# EAGLE design relay_pro_eagle7x (EAGLE 7.7.0)
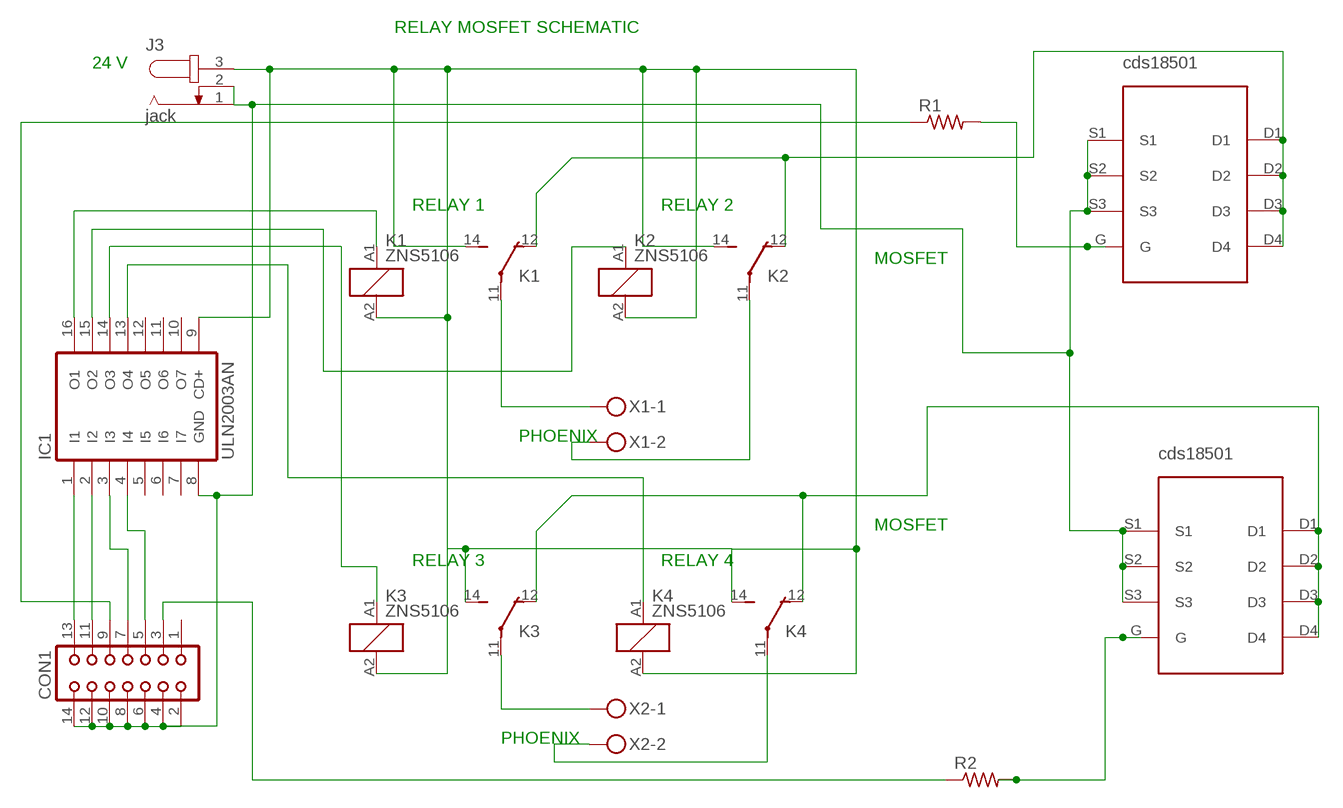
[diagram p0: schematic, sheet 1]

## Parts
CON1  CON14  [CON14]
IC1  ULN2003AN  [DIL16]
J3  jack  JACK-PLUG0  [SPC4077]
K1  ZNS5106  [ZN5]
K2  ZNS5106  [ZN5]
K3  ZNS5106  [ZN5]
K4  ZNS5106  [ZN5]
R1  R-US_R0603  [R0603]
R2  R-US_R0603  [R0603]
U$1  CSD18503GDS-NEW  [CDS]
U$2  CSD18503GDS-NEW  [CDS]
X1  MKDSN1,5/2-5,08  [MKDSN1,5/2-5,08]
X2  MKDSN1,5/2-5,08  [MKDSN1,5/2-5,08]

## Nets
N$1: K1.11(2:P) X1.1
N$2: IC1.16(O1) K1.A1
N$3: K2.11(2:P) X1.2
N$4: IC1.15(O2) K2.A1
N$5: K3.11(2:P) X2.1
N$6: IC1.9(CD+) J3.3 K1.14(2:S) K1.A2 K2.14(2:S) K2.A2 K3.14(2:S) K3.A2 K4.14(2:S) K4.A2
N$7: CON1.13 IC1.1(I1)
N$8: K4.11(2:P) X2.2
N$9: CON1.11 IC1.2(I2)
N$10: CON1.7 IC1.3(I3)
N$11: IC1.14(O3) K3.A1
N$12: IC1.13(O4) K4.A1
N$13: CON1.9 R1.1
N$15: K3.12(2:O) K4.12(2:O) U$2.D1 U$2.D2 U$2.D3 U$2.D4
N$16: CON1.3 R2.1
N$17: R2.2 U$2.G
N$18: CON1.5 IC1.4(I4)
N$19: K1.12(2:O) K2.12(2:O) U$1.D1 U$1.D2 U$1.D3 U$1.D4
N$21: R1.2 U$1.G
N$23: CON1.2 CON1.4 CON1.6 CON1.8 CON1.10 CON1.12 CON1.14 IC1.8(GND) J3.1 J3.2 U$1.S1 U$1.S2 U$1.S3 U$2.S1 U$2.S2 U$2.S3
Unconnected: CON1.1 IC1.5(I5) IC1.6(I6) IC1.7(I7) IC1.10(O7) IC1.11(O6) IC1.12(O5)

## Notes on the sheet
- RELAY MOSFET SCHEMATIC
- 24 V
- RELAY 1 | RELAY 2
- MOSFET
- PHOENIX
- MOSFET
- RELAY 3 | RELAY 4
- PHOENIX

## Library data of the parts
CON1 = con-harting:CON14: CONNECTOR
IC1 = uln-udn:ULN2003A: DRIVER ARRAY
J3 = con-jack:JACK-PLUG: DC POWER JACK Power Jack, DC, Right Angle, Through Hole, Rated 5A at 16VDC, PC Terminals Distributor: Farnell (www.Farnell.de) Drawing: 84N1161.pdf / 84N1162.pdf Manufacturer: SPC Technology (www.spctechnology.com) Type: SPC4077 / SPC 4078
K1-K4 = relay1:ZNS5*: Miniature Power PCB Relay SCHRACK 1pole 10 A Source: http://www.schrack.com/.. 5847.pdf
R1 R2 = rcl:R-US_: RESISTOR, American symbol
U$1 U$2 = cds_new:CSD18503GDS-NEW
X1 X2 = con-phoenix-508:MKDSN1,5/2-5,08: MKDSN 1,5/ 2-5,08 Printklemme Nennstrom: 13,5 A Nennspannung: 250 V Rastermaß: 5,08 mm Polzahl: 2 Anschlussart: Schraubanschluss Montage: Löten Anschlussrichtung Leiter/Platine: 0 ° Artikelnummer: 1729128 Source: http://eshop.phoenixcontact.com .. 1729128.pdf

## Board
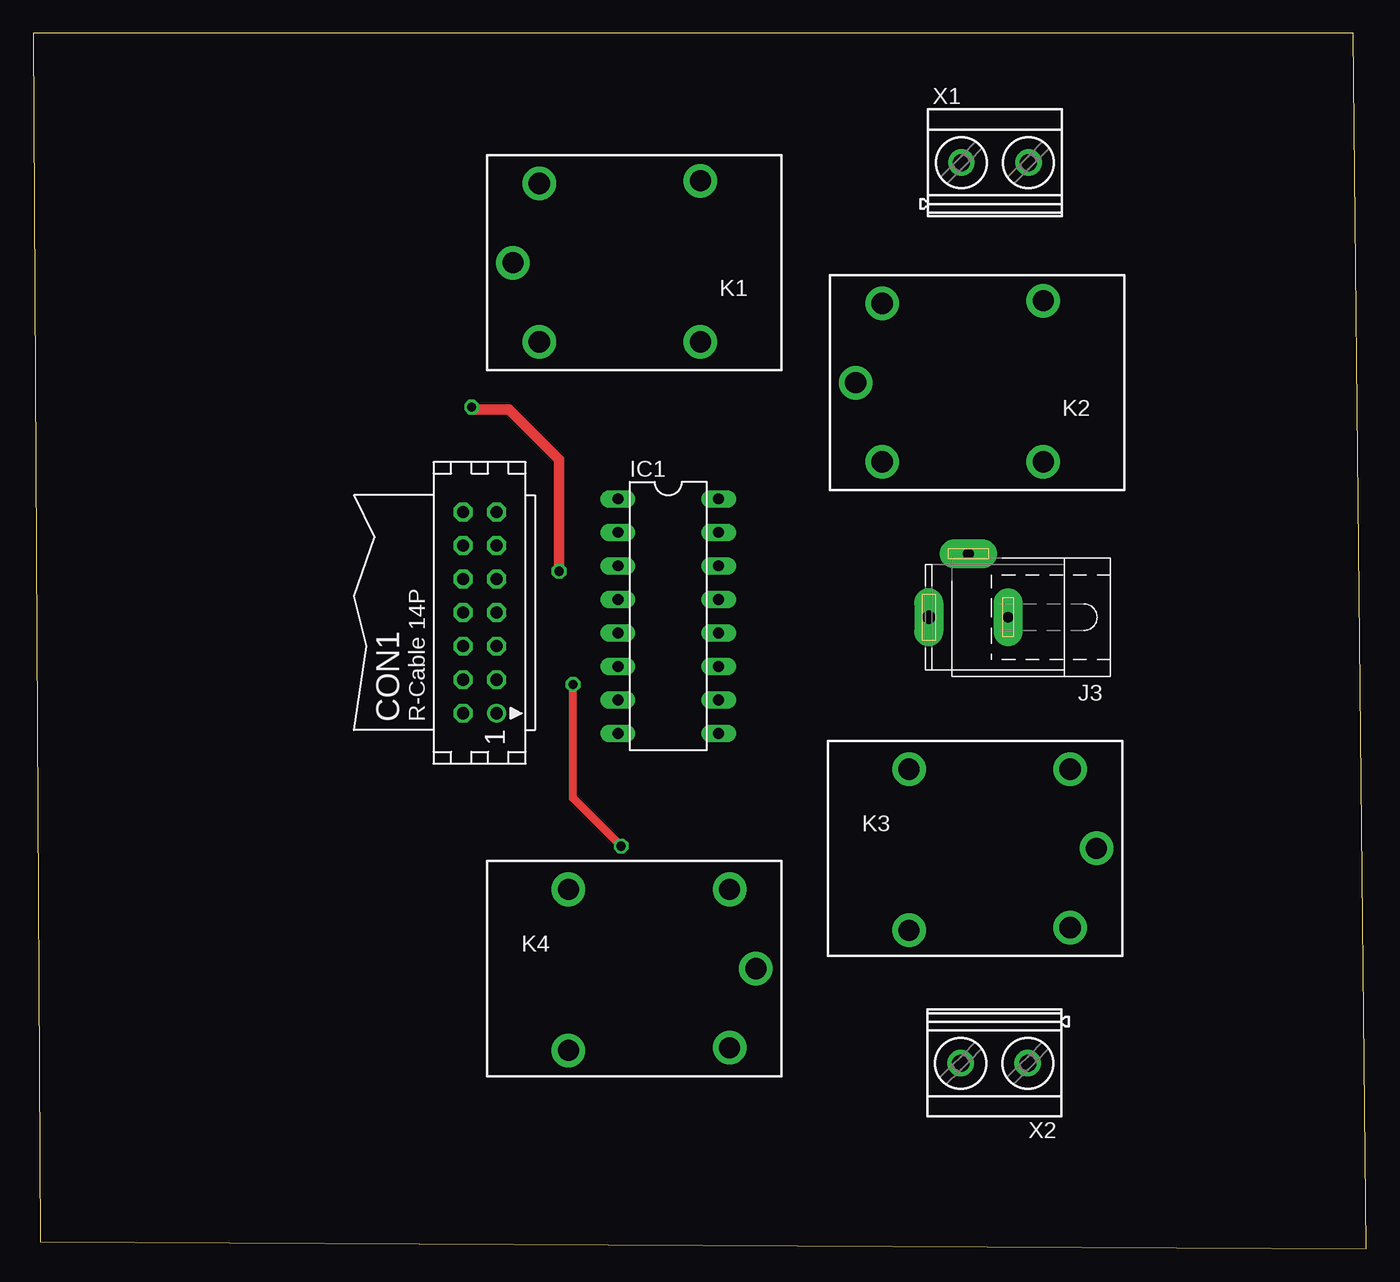
[diagram p1: board, top side]
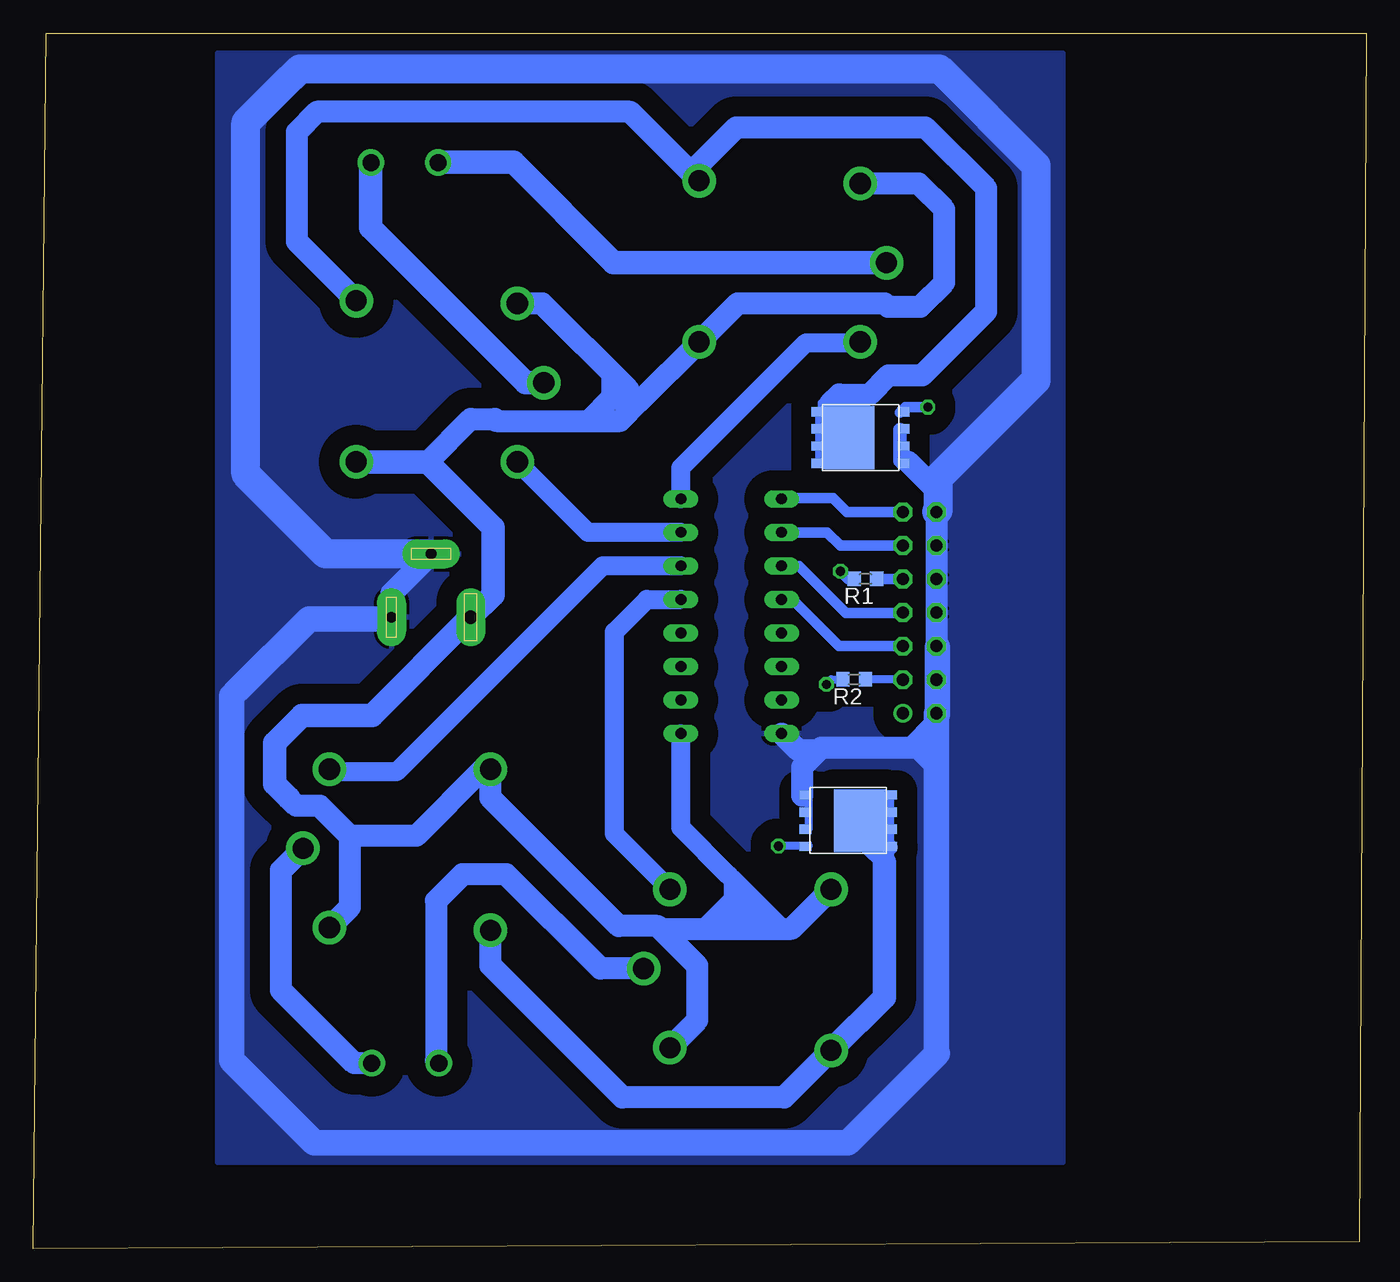
[diagram p2: board, bottom side, seen from below]

Size 101 x 92.08 mm. Coordinates in mm from the lower left corner, seen from the top.
Outline: 0.54,0.54 101,0 100,92.08 0,92.08 0.54,0.54
Copper layers (1*16): Top 0.035mm / dielectric 1.5mm / Bottom 0.035mm
Design rules "default *": minimum track width 10mil, minimum drill 24mil, track to track 60mil, track to pad 60mil, pad to pad 60mil, via to via 60mil, smd to smd 8mil, copper to edge 40mil, drill to drill 8mil, minimum pad ring 10mil, minimum via ring 8mil, stop-mask expansion 4mil, vias tented up to drill 0mil, thermal gap 10mil

### Footprints (pad centres in the part's own frame; a part is rotated, then mirrored left to right if it is on the bottom)
CON14 = drill 0.914: 1 -7.62,-1.27 | drill 0.914 octagon: 2 -7.62,1.27; 3 -5.08,-1.27; 4 -5.08,1.27; 5 -2.54,-1.27; 6 -2.54,1.27; 7 0,-1.27; 8 0,1.27; 9 2.54,-1.27; 10 2.54,1.27; 11 5.08,-1.27; 12 5.08,1.27; 13 7.62,-1.27; 14 7.62,1.27
DIL16 = drill 0.813 long: 1 -8.89,-3.81; 2 -6.35,-3.81; 3 -3.81,-3.81; 4 -1.27,-3.81; 5 1.27,-3.81; 6 3.81,-3.81; 7 6.35,-3.81; 8 8.89,-3.81; 9 8.89,3.81; 10 6.35,3.81; 11 3.81,3.81; 12 1.27,3.81; 13 -1.27,3.81; 14 -3.81,3.81; 15 -6.35,3.81; 16 -8.89,3.81
SPC4077 = drill 0.8 pad 2.184 long: 1 -3,0; 2 0,-4.8 | drill 1 pad 2.184 long: 3 3,0
ZN5 = drill 1.6 pad 2.54: 11 8.89,0; 12 -5.31,-6.2; 14 -5.31,6; A1 6.89,6; A2 6.89,-6
R0603 = smd 1 x 1.1: 1 -0.85,0; 2 0.85,0
CDS = smd 0.406 x 0.203: D1 1,-0.9; D2 1,0.4; D3 1,1.7; D4 1,3; G 7.1,2.9; P$1 7.2,3.1; P$2 7.2,2.9; P$3 7.2,2.7; P$4 7.5,1.9; P$5 7.6,3.1; P$6 7.6,2.9; P$7 7.6,2.7; P$8 7.6,1.9; P$9 7.1,3.1; P$11 7.1,2.7; P$12 7.5,1.7; P$13 7.2,-1.1; P$14 7.6,-1.1; P$16 7.6,-0.9; P$17 7.1,-0.9; P$18 7.1,-1.1; P$19 7.1,-0.7; P$20 7.5,-0.7; P$21 7.6,-0.7; P$22 7.1,-1.2; P$23 7.5,-1.2; P$24 7.6,-1.2; P$25 7.1,3.2; P$26 7.5,3.2; P$27 7.6,3.2; P$28 7.1,0.1; P$30 7.1,0.5; P$31 7.1,0.6; P$32 7.1,1.4; P$34 7.1,1.8; P$35 7.1,1.9; P$36 7.6,1.7; P$37 7.5,1.5; P$38 7.6,1.5; P$39 7.5,1.4; P$40 7.6,1.4; P$41 7.5,0.6; P$42 7.6,0.6; P$43 7.5,0.4; P$44 7.6,0.4; P$45 7.5,0.2; P$46 7.6,0.2; P$47 7.5,0.1; P$48 7.6,0.1; P$68 1,3.2; P$69 0.6,3.2; P$70 0.6,3; P$72 1.1,3.2; P$73 1.2,3; P$74 0.6,2.8; P$75 1,2.8; P$76 1.1,2.8; P$77 0.6,2.7; P$78 1,2.7; P$79 1.1,2.7; P$80 1.1,1.9; P$81 0.7,1.9; P$82 0.6,1.9; P$83 0.6,1.7; P$85 1.1,1.7; P$86 0.6,1.5; P$87 1,1.5; P$88 1.2,1.5; P$89 0.6,1.4; P$90 1,1.4; P$91 1.2,1.4; P$92 0.6,0.6; P$93 1,0.6; P$94 1.1,0.6; P$95 0.6,0.4; P$97 1.2,0.4; P$98 0.6,0.2; P$99 1,0.2; P$100 1.2,0.2; P$101 0.6,0.1; P$102 1,0.1; P$103 1.1,0.1; P$104 0.6,-0.7; P$105 0.9,-0.7; P$106 1.1,-0.7; P$107 0.6,-0.9; P$109 1.1,-0.9; P$110 0.6,-1.1; P$111 1.1,-1.1; P$112 1,-1.1; P$113 0.6,-1.2; P$114 1,-1.2; P$115 1.1,-1.2; S1 7.2,-0.9; S2 7.1,0.3; S3 7.1,1.6 | smd 1.93 x 0.965: P$49 4.2,-0.9; P$50 2.3,-0.9; P$51 2.3,0; P$52 4.2,0; P$53 4.2,0.9; P$54 2.3,0.9; P$55 4.2,1.8; P$56 2.3,1.8; P$57 2.3,2.7; P$58 4.2,2.7; P$59 4.2,2.9; P$60 2.3,2.9; P$61 2.2,2.9; P$62 2.2,1.9; P$63 2.2,2; P$64 2.2,1; P$65 2.2,0; P$66 2.2,0.1; P$67 2.2,-0.9
MKDSN1,5/2-5,08 = drill 1.3 pad 2: 1 -2.561,0.025; 2 2.519,0.025

### Placement (x,y rotation side)
CON1  33.84,48.18 90 top
IC1  48.12,47.91 270 top
J3  70.85,47.83 180 top
K1  45.24,74.68 180 top
K2  71.21,65.6 180 top
K3  71.66,30.32 0 top
K4  45.87,21.21 0 top
R1  37.96,50.73 180 bottom
R2  38.8,43.12 180 bottom
U$1  42.42,60.45 0 bottom
U$2  35.16,33.42 180 bottom
X1  72.88,82.24 0 top
X2  72.79,14.07 180 top

### Tracks (layer width: path | path; a pad name or v marks a point on that pad's centre or on a via)
N$1
  Bottom 1.778: K1.11 57.02,74.68 64.62,82.28 70.3,82.28 X1.1
N$2
  Bottom 1.422: IC1.16 51.93,59.15 42.45,68.62 38.41,68.62 K1.A1
N$3
  Bottom 1.778: K2.11 63.7,65.6 75.44,77.34 75.44,82.22 X1.2
N$4
  Bottom 1.422: IC1.15 58.98,54.26 K2.A1
N$5
  Bottom 1.676: X2.1 76.67,14.05 82.21,19.58 82.21,28.66 K3.11
N$6
  Bottom 1.422: IC1.9 51.93,31.9 48.31,28.28 47.9,27.88 | 47.9,27.88 47.9,26.38 49.24,25.04 47,25.04 46.84,24.88 | 50.2,24.23 47.96,26.48 47.96,27.82 46.84,26.7 46.84,26.27 45.6,25.04 46.62,25.04 47.48,25.9 45.98,25.9 44.32,24.24 44.32,24.29 47.9,27.88
  Bottom 1.676: K3.A2 78.49,24.32 | K3.A2 78.35,24.32 | K2.14 71.09,59.6 67.84,62.85 66.02,62.85 arc-90 65.87,62.7 58.89,62.7 | 58.89,62.7 56.54,62.7 55.05,64.19 | 57.09,66.21 57.09,64.5 58.89,62.7 | K2.A2 62.43,71.6 55.92,65.09 55.92,64.61 56.35,64.19 55.05,64.19 | 55.05,64.19 K1.14 47.62,71.61 36.49,71.61 36.22,71.34 33.81,71.34 31.97,73.18 31.97,78.73 33.92,80.68 K1.A2 | 81.63,34.13 81.63,34.1 81.34,33.81 81.33,33.81 81.06,33.54 79.29,33.54 77.03,31.28 | 77.03,31.28 77,31.26 77,25.86 K3.A2 | 77.03,31.28 71.98,31.28 66.94,36.32 K3.14 66.35,34.15 56.65,24.45 53.69,24.45 53.47,24.23 | 53.47,24.23 50.67,21.43 50.67,17.3 K4.A2 | K4.14 43.54,24.23 50.2,24.23 53.47,24.23
  Bottom 1.778: K2.14 71.12,59.6 66.17,54.64 66.17,49.51 J3.3 67.88,47.83 75.32,40.39 80.61,40.39 82.7,38.3 82.7,35.2 81.63,34.13
N$7
  Bottom 0.813: CON1.13 39.35,55.8 40.42,56.86 44.24,56.86 IC1.1
N$8
  Bottom 1.676: K4.11 58.02,21.21 65.17,28.36 68.47,28.36 70.47,26.36 70.47,14.25 X2.2
N$9
  Bottom 0.813: CON1.11 39.86,53.26 40.86,54.26 IC1.2
N$10
  Bottom 0.813: IC1.3 42.98,51.72 39.41,48.15 35.14,48.15 CON1.7
N$11
  Bottom 1.422: IC1.14 57.85,51.72 73.46,36.11 78.34,36.11 K3.A1
N$12
  Bottom 1.422: IC1.13 54.5,49.18 56.96,46.72 56.96,31.42 K4.A1
N$13
  Bottom 0.813: CON1.9 37.09,50.72 R1.1
N$15
  Bottom 0.813: U$2.D1 U$2.D2 U$2.D3 U$2.D4 36.16,29.61
  Bottom 1.27: 36.52,29.26 37.79,30.52 37.79,30.9 37.31,30.42 U$2.D4
  Bottom 1.676: K4.12 44.11,11.46 56.35,11.46 66.35,21.46 K3.12
  Bottom 1.778: K4.12 36.52,19.05 36.52,29.26
N$16
  Bottom 0.61: CON1.3 37.93,43.1 R2.1
N$17  (via drill 0.7)
  Top 0.61: v44.54,30.49 40.9,34.13 v40.9,42.74
  Bottom 0.61: U$2.G 42.29,30.49 v44.54,30.49 | v40.9,42.74 40.53,43.12 R2.2
N$18
  Bottom 0.813: CON1.5 39.95,45.64 43.45,49.14 43.53,49.14 43.6,49.2 44.28,49.2 IC1.4
N$19
  Bottom 0.61: 40.62,64.03 41.22,64.03 41.25,64.07 41.25,63.62 U$1.D4 U$1.D3 U$1.D2 U$1.D1
  Bottom 1.676: K2.12 81.03,76.31 81.03,84.58 79.5,86.1 55.77,86.1 K1.12 50.55,82.11 47.74,84.91 33.41,84.91 28.8,80.31 28.8,71 33.64,66.16 36.17,66.16 37.63,64.71 39.95,64.71 40.62,64.03
N$21  (via drill 0.7)
  Top 0.813: v39.84,51.31 39.84,59.77 36.07,63.54 33.42,63.54 v33.23,63.74
  Bottom 0.813: R1.2 39.27,50.73 v39.84,51.31 | v33.23,63.74 34.93,63.74 U$1.G
N$23
  Bottom 0.406: 34.7,59.59 35.18,59.59 U$1.S1 | U$2.S1 42.75,34.32
  Bottom 0.61: U$2.S3 42.33,31.85 42.26,31.93 U$2.S2 42.26,34.32 U$2.S1 42.36,34.45 42.21,34.6 42.21,34.63 42.41,34.82 42.41,34.6 42.26,34.45 42.26,34.93 42.27,34.94
  Bottom 1.016: U$1.S3 U$1.S2 35.32,59.65 U$1.S1
  Bottom 1.676: J3.2 73.85,49.63 J3.1 73.99,47.69 | CON1.4 32.57,43.31 32.51,43.37 | 32.51,45.58 CON1.6 CON1.8 CON1.10 CON1.12 CON1.14 32.57,57.46 34.7,59.59 | 42.75,34.32 42.75,36.49 41.5,37.74 | 32.57,36.94 32.96,36.94 33.84,37.82 | 41.5,37.74 41.31,37.93 34.48,37.93 32.67,39.73 32.57,39.73 | IC1.8 43.03,37.74 41.5,37.74
  Bottom 1.93: 73.99,47.69 80.09,47.69 85.52,42.26 85.57,42.26 85.97,41.86 85.97,14.28 79.69,8 39.29,8 32.51,14.78 32.57,14.85 32.57,36.94 32.57,39.73 CON1.2 | 32.51,45.58 32.51,40.45 32.56,40.4
  Bottom 2.184: J3.2 78.85,52.63 84.24,58.02 84.24,58.04 84.88,58.67 84.88,85.3 81.5,88.68 81.47,88.68 80.78,89.36 32.36,89.36 25.03,82.03 25.03,65.78 32.45,58.36 32.45,55.91 CON1.14
  pour Bottom: 23,90.54 23,6.54 87,6.54 87,90.54